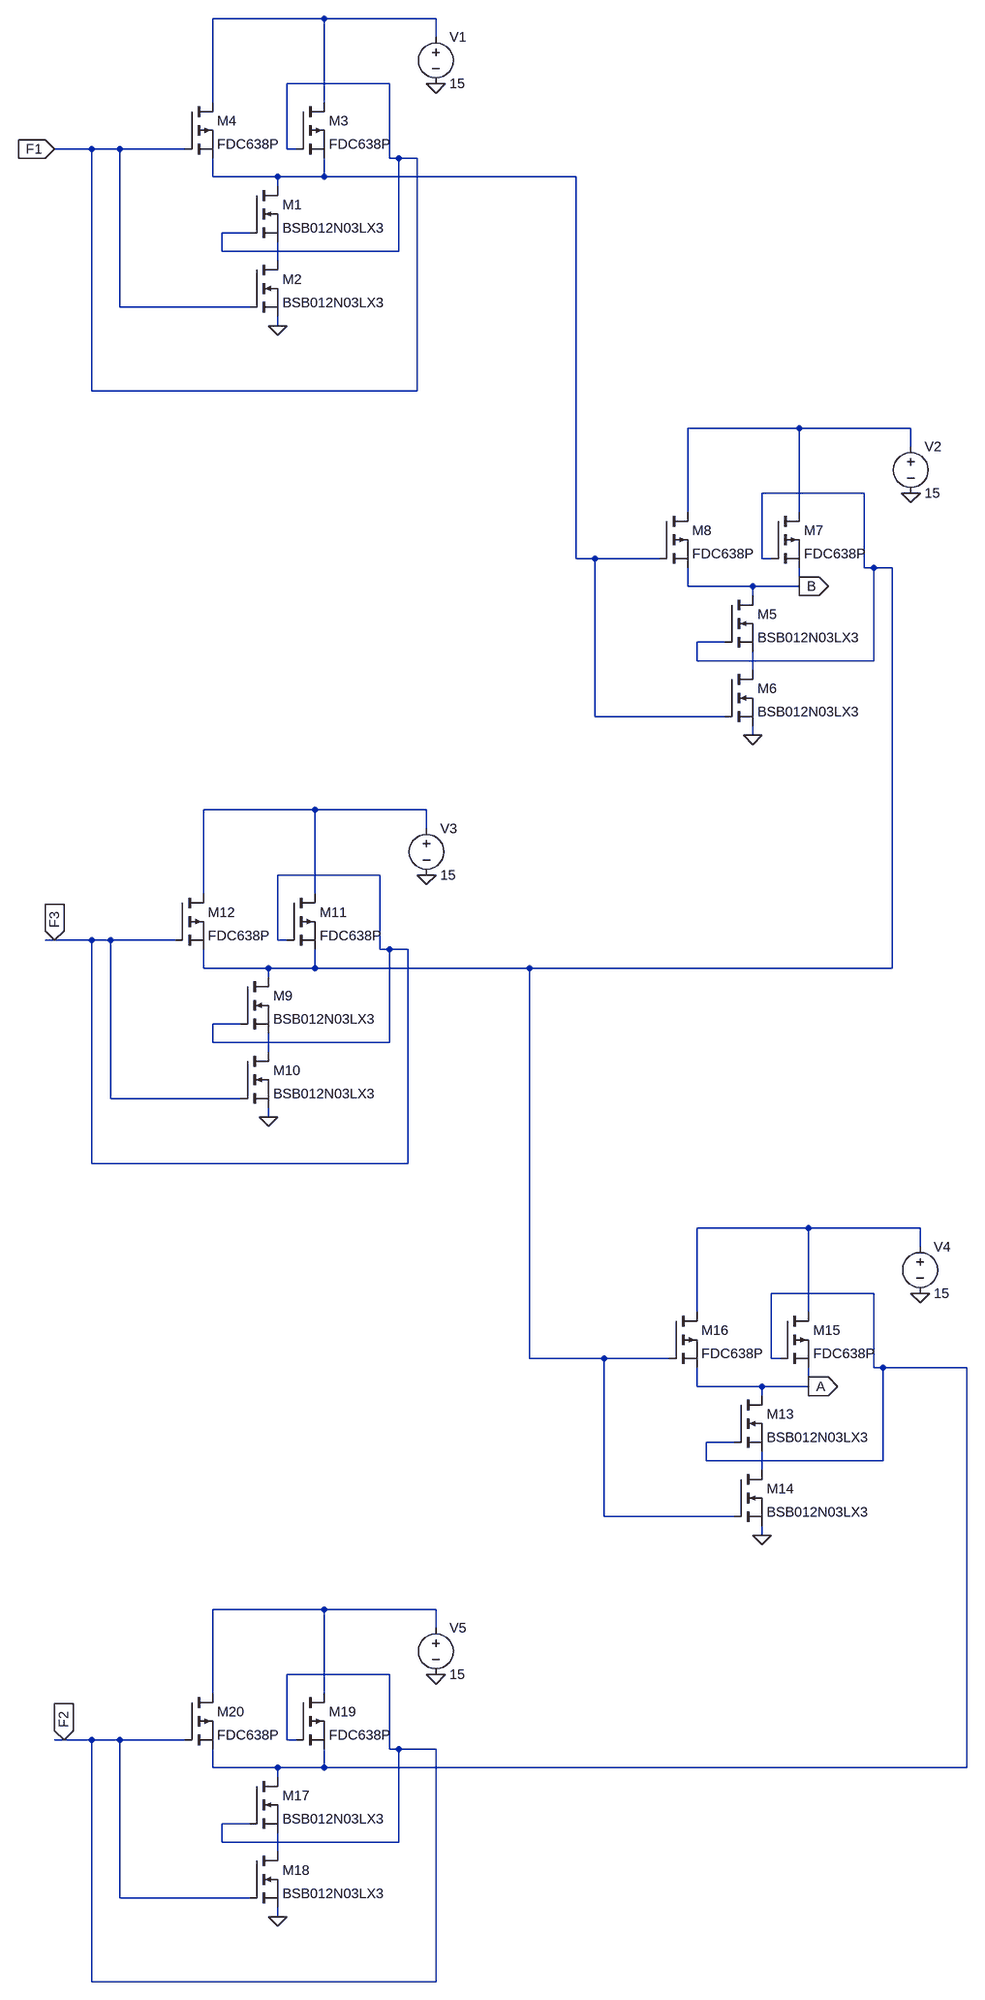
[diagram p0: schematic ENCODER_EXP5.asc]
ENCODER_EXP5.asc, the LTspice schematic file:
Version 4
SHEET 1 1188 2036
WIRE 32 -1888 -160 -1888
WIRE 224 -1888 32 -1888
WIRE 224 -1856 224 -1888
WIRE 144 -1776 -32 -1776
WIRE -160 -1744 -160 -1888
WIRE 32 -1744 32 -1888
WIRE -368 -1664 -432 -1664
WIRE -320 -1664 -368 -1664
WIRE -208 -1664 -320 -1664
WIRE -32 -1664 -32 -1776
WIRE -16 -1664 -32 -1664
WIRE 144 -1648 144 -1776
WIRE 160 -1648 144 -1648
WIRE 192 -1648 160 -1648
WIRE -160 -1616 -160 -1648
WIRE -48 -1616 -160 -1616
WIRE 32 -1616 32 -1648
WIRE 32 -1616 -48 -1616
WIRE 512 -1616 32 -1616
WIRE -48 -1600 -48 -1616
WIRE -96 -1520 -144 -1520
WIRE -144 -1488 -144 -1520
WIRE 160 -1488 160 -1648
WIRE 160 -1488 -144 -1488
WIRE -48 -1472 -48 -1504
WIRE -320 -1392 -320 -1664
WIRE -96 -1392 -320 -1392
WIRE -48 -1360 -48 -1376
WIRE -368 -1248 -368 -1664
WIRE 192 -1248 192 -1648
WIRE 192 -1248 -368 -1248
WIRE 896 -1184 704 -1184
WIRE 1088 -1184 896 -1184
WIRE 1088 -1152 1088 -1184
WIRE 1008 -1072 832 -1072
WIRE 704 -1040 704 -1184
WIRE 896 -1040 896 -1184
WIRE 512 -960 512 -1616
WIRE 544 -960 512 -960
WIRE 656 -960 544 -960
WIRE 832 -960 832 -1072
WIRE 848 -960 832 -960
WIRE 1008 -944 1008 -1072
WIRE 1024 -944 1008 -944
WIRE 1056 -944 1024 -944
WIRE 704 -912 704 -944
WIRE 816 -912 704 -912
WIRE 896 -912 896 -944
WIRE 896 -912 816 -912
WIRE 816 -896 816 -912
WIRE 768 -816 720 -816
WIRE 720 -784 720 -816
WIRE 1024 -784 1024 -944
WIRE 1024 -784 720 -784
WIRE 816 -768 816 -800
WIRE 544 -688 544 -960
WIRE 768 -688 544 -688
WIRE 816 -656 816 -672
WIRE 16 -336 -176 -336
WIRE 208 -336 16 -336
WIRE 208 -304 208 -336
WIRE 128 -224 -48 -224
WIRE -176 -192 -176 -336
WIRE 16 -192 16 -336
WIRE -432 -112 -448 -112
WIRE -368 -112 -432 -112
WIRE -336 -112 -368 -112
WIRE -224 -112 -336 -112
WIRE -48 -112 -48 -224
WIRE -32 -112 -48 -112
WIRE 128 -96 128 -224
WIRE 144 -96 128 -96
WIRE 176 -96 144 -96
WIRE -176 -64 -176 -96
WIRE -64 -64 -176 -64
WIRE 16 -64 16 -96
WIRE 16 -64 -64 -64
WIRE 432 -64 16 -64
WIRE 1056 -64 1056 -944
WIRE 1056 -64 432 -64
WIRE -64 -48 -64 -64
WIRE -112 32 -160 32
WIRE -160 64 -160 32
WIRE 144 64 144 -96
WIRE 144 64 -160 64
WIRE -64 80 -64 48
WIRE -336 160 -336 -112
WIRE -112 160 -336 160
WIRE -64 192 -64 176
WIRE -368 272 -368 -112
WIRE 176 272 176 -96
WIRE 176 272 -368 272
WIRE 912 528 720 528
WIRE 1104 528 912 528
WIRE 1104 560 1104 528
WIRE 1024 640 848 640
WIRE 720 672 720 528
WIRE 912 672 912 528
WIRE 432 752 432 -64
WIRE 560 752 432 752
WIRE 672 752 560 752
WIRE 848 752 848 640
WIRE 864 752 848 752
WIRE 1024 768 1024 640
WIRE 1040 768 1024 768
WIRE 1184 768 1040 768
WIRE 720 800 720 768
WIRE 832 800 720 800
WIRE 912 800 912 768
WIRE 912 800 832 800
WIRE 832 816 832 800
WIRE 784 896 736 896
WIRE 736 928 736 896
WIRE 1040 928 1040 768
WIRE 1040 928 736 928
WIRE 832 944 832 912
WIRE 560 1024 560 752
WIRE 784 1024 560 1024
WIRE 832 1056 832 1040
WIRE 32 1392 -160 1392
WIRE 224 1392 32 1392
WIRE 224 1424 224 1392
WIRE 144 1504 -32 1504
WIRE -160 1536 -160 1392
WIRE 32 1536 32 1392
WIRE -416 1616 -432 1616
WIRE -368 1616 -416 1616
WIRE -320 1616 -368 1616
WIRE -208 1616 -320 1616
WIRE -32 1616 -32 1504
WIRE -16 1616 -32 1616
WIRE 144 1632 144 1504
WIRE 160 1632 144 1632
WIRE 224 1632 160 1632
WIRE -160 1664 -160 1632
WIRE -48 1664 -160 1664
WIRE 32 1664 32 1632
WIRE 32 1664 -48 1664
WIRE 1184 1664 1184 768
WIRE 1184 1664 32 1664
WIRE -48 1680 -48 1664
WIRE -96 1760 -144 1760
WIRE -144 1792 -144 1760
WIRE 160 1792 160 1632
WIRE 160 1792 -144 1792
WIRE -48 1808 -48 1776
WIRE -320 1888 -320 1616
WIRE -96 1888 -320 1888
WIRE -48 1920 -48 1904
WIRE -368 2032 -368 1616
WIRE 224 2032 224 1632
WIRE 224 2032 -368 2032
FLAG 224 -1776 0
FLAG -48 -1360 0
FLAG 1088 -1072 0
FLAG 816 -656 0
FLAG 208 -224 0
FLAG -64 192 0
FLAG 1104 640 0
FLAG 832 1056 0
FLAG 224 1504 0
FLAG -48 1920 0
FLAG -432 -1664 F1
IOPIN -432 -1664 In
FLAG -432 -112 F3
IOPIN -432 -112 In
FLAG -416 1616 F2
IOPIN -416 1616 In
FLAG 896 -912 B
IOPIN 896 -912 Out
FLAG 912 800 A
IOPIN 912 800 Out
SYMBOL nmos -96 -1600 R0
SYMATTR InstName M1
SYMATTR Value BSB012N03LX3
SYMBOL nmos -96 -1472 R0
SYMATTR InstName M2
SYMATTR Value BSB012N03LX3
SYMBOL pmos -16 -1744 R0
SYMATTR InstName M3
SYMATTR Value FDC638P
SYMBOL pmos -208 -1744 R0
SYMATTR InstName M4
SYMATTR Value FDC638P
SYMBOL voltage 224 -1872 R0
SYMATTR InstName V1
SYMATTR Value 15
SYMBOL nmos 768 -896 R0
SYMATTR InstName M5
SYMATTR Value BSB012N03LX3
SYMBOL nmos 768 -768 R0
SYMATTR InstName M6
SYMATTR Value BSB012N03LX3
SYMBOL pmos 848 -1040 R0
SYMATTR InstName M7
SYMATTR Value FDC638P
SYMBOL pmos 656 -1040 R0
SYMATTR InstName M8
SYMATTR Value FDC638P
SYMBOL voltage 1088 -1168 R0
SYMATTR InstName V2
SYMATTR Value 15
SYMBOL nmos -112 -48 R0
SYMATTR InstName M9
SYMATTR Value BSB012N03LX3
SYMBOL nmos -112 80 R0
SYMATTR InstName M10
SYMATTR Value BSB012N03LX3
SYMBOL pmos -32 -192 R0
SYMATTR InstName M11
SYMATTR Value FDC638P
SYMBOL pmos -224 -192 R0
SYMATTR InstName M12
SYMATTR Value FDC638P
SYMBOL voltage 208 -320 R0
SYMATTR InstName V3
SYMATTR Value 15
SYMBOL nmos 784 816 R0
SYMATTR InstName M13
SYMATTR Value BSB012N03LX3
SYMBOL nmos 784 944 R0
SYMATTR InstName M14
SYMATTR Value BSB012N03LX3
SYMBOL pmos 864 672 R0
SYMATTR InstName M15
SYMATTR Value FDC638P
SYMBOL pmos 672 672 R0
SYMATTR InstName M16
SYMATTR Value FDC638P
SYMBOL voltage 1104 544 R0
SYMATTR InstName V4
SYMATTR Value 15
SYMBOL nmos -96 1680 R0
SYMATTR InstName M17
SYMATTR Value BSB012N03LX3
SYMBOL nmos -96 1808 R0
SYMATTR InstName M18
SYMATTR Value BSB012N03LX3
SYMBOL pmos -16 1536 R0
SYMATTR InstName M19
SYMATTR Value FDC638P
SYMBOL pmos -208 1536 R0
SYMATTR InstName M20
SYMATTR Value FDC638P
SYMBOL voltage 224 1408 R0
SYMATTR InstName V5
SYMATTR Value 15

The netlist it stands for:
* ENCODER_EXP5.asc
M1 N002 F1 N003 N003 BSB012N03LX3
M2 N003 F1 0 0 BSB012N03LX3
M3 N001 F1 N002 N002 FDC638P
M4 N001 F1 N002 N002 FDC638P
V1 N001 0 15
M5 B N005 N006 N006 BSB012N03LX3
M6 N006 N002 0 0 BSB012N03LX3
M7 N004 N005 B B FDC638P
M8 N004 N002 B B FDC638P
V2 N004 0 15
M9 N005 F3 N008 N008 BSB012N03LX3
M10 N008 F3 0 0 BSB012N03LX3
M11 N007 F3 N005 N005 FDC638P
M12 N007 F3 N005 N005 FDC638P
V3 N007 0 15
M13 A N010 N011 N011 BSB012N03LX3
M14 N011 N005 0 0 BSB012N03LX3
M15 N009 N010 A A FDC638P
M16 N009 N005 A A FDC638P
V4 N009 0 15
M17 N010 F2 N013 N013 BSB012N03LX3
M18 N013 F2 0 0 BSB012N03LX3
M19 N012 F2 N010 N010 FDC638P
M20 N012 F2 N010 N010 FDC638P
V5 N012 0 15
.model NMOS NMOS
.model PMOS PMOS
.lib standard.mos
.backanno
.end